# Altium schematic sheet 3V3_REG.SchDoc
size A4; SheetNumber: 11; SheetTotal: 19
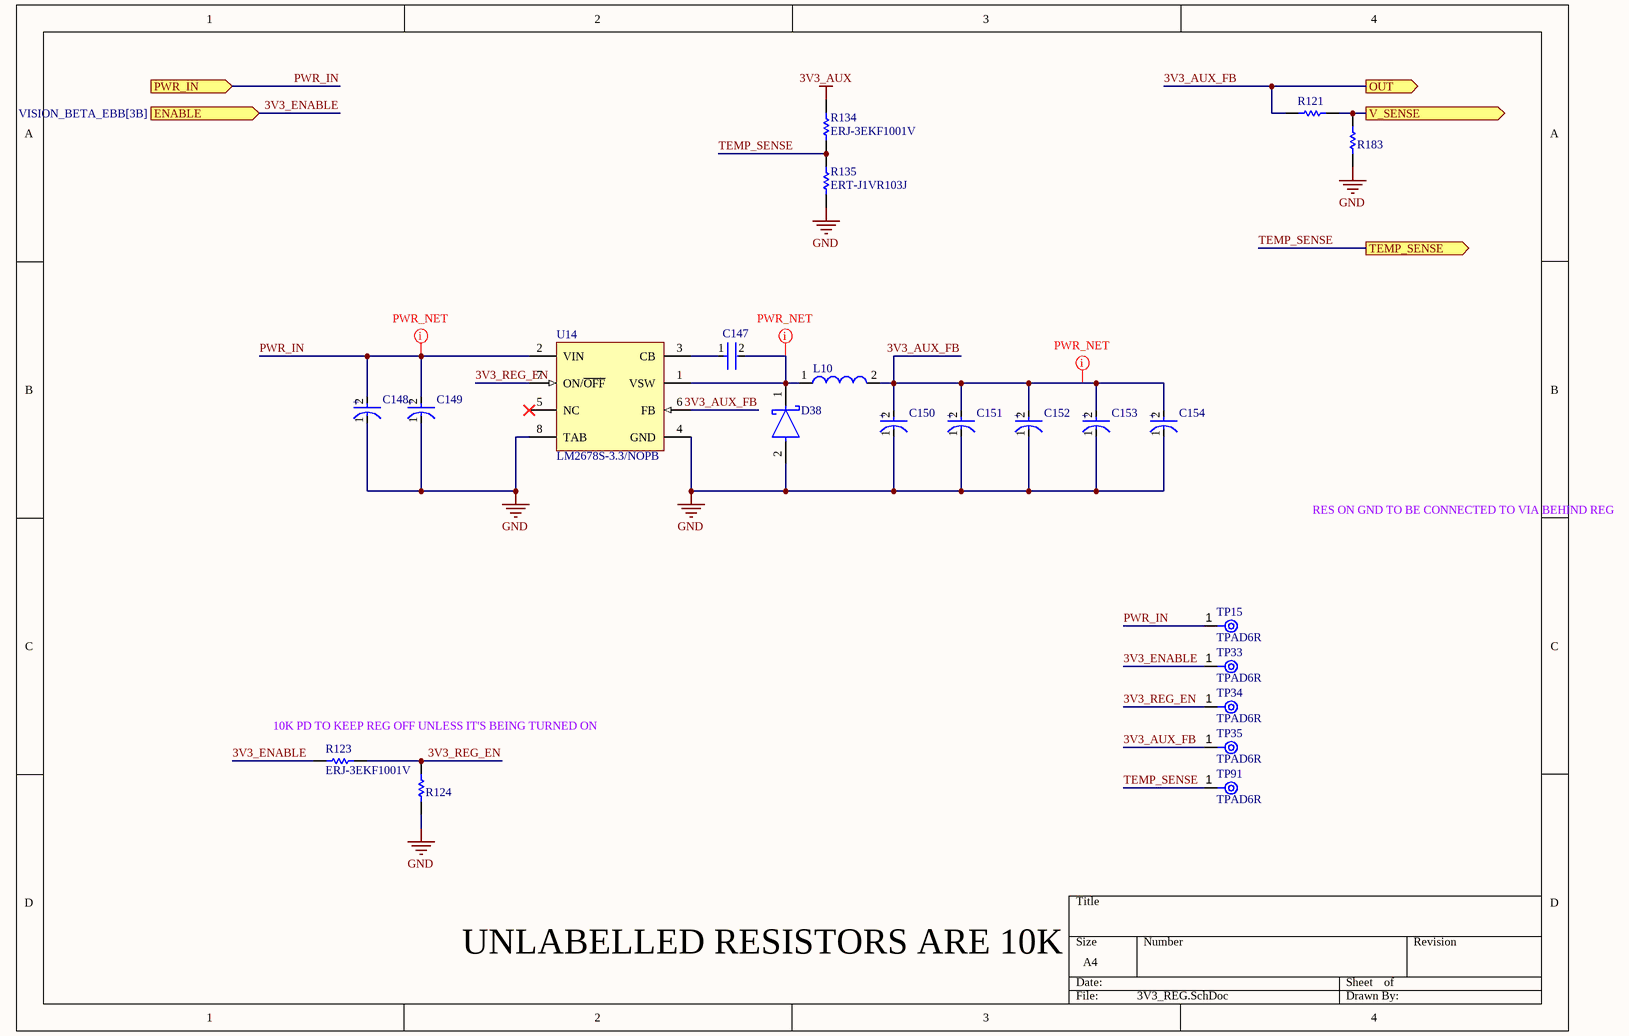
[diagram p0: 3V3_REG.SchDoc]

## Parts
C147  C0805C103J5RACTU  [FP-C0805C-DN-MFG]  (value not drawn)
C148  EEHZA1V680XP  [FP-EEH-D8-MFG]  (value not drawn)
C149  EEHZA1V680XP  [FP-EEH-D8-MFG]  (value not drawn)
C150  16SVPC120M  [FP-OS-CON-SMT-E7-MFG]  (value not drawn)
C151  16SVPC120M  [FP-OS-CON-SMT-E7-MFG]  (value not drawn)
C152  16SVPC120M  [FP-OS-CON-SMT-E7-MFG]  (value not drawn)
C153  16SVPC120M  [FP-OS-CON-SMT-E7-MFG]  (value not drawn)
C154  16SVPC120M  [FP-OS-CON-SMT-E7-MFG]  (value not drawn)
D38  B540C-13-F  [FP-SMC-MFG]  (value not drawn)
L10  74477110  [WE-PD-L]  (value not drawn)
R121  ERJ3EKF1002V  [RESC1609X55X30LL15T15]  (value not drawn)
R123  ERJ-3EKF1001V  [RESC1608X55X30LL15T15]
R124  ERJ3EKF1002V  [RESC1609X55X30LL15T15]  (value not drawn)
R134  ERJ-3EKF1001V  [RESC1608X55X30LL15T15]
R135  ERT-J1VR103J  [RESC1608X90X30ML15T20]
R183  ERJ3EKF1002V  [RESC1609X55X30LL15T15]  (value not drawn)
TP15  TPAD6R  [New footprint 1]
TP33  TPAD6R  [New footprint 1]
TP34  TPAD6R  [New footprint 1]
TP35  TPAD6R  [New footprint 1]
TP91  TPAD6R  [New footprint 1]
U14  LM2678S-3.3/NOPB  [KTW0007B_N]

## Ports
ENABLE (in, see VISION_BETA_EBB[3B]), OUT (out, see VISION_BETA_EBB[3B]), PWR_IN (in, see VISION_BETA_EBB[3B]), TEMP_SENSE (out, see VISION_BETA_EBB[3B]), V_SENSE (out, see VISION_BETA_EBB[3B])

## Nets
3V3_AUX: R134.2
GND: C148.1(C) C149.1(C) C150.1(C) C151.1(C) C152.1(C) C153.1(C) C154.1(C) D38.2(A) R124.1 R135.1 R183.1 U14.4(GND) U14.8(TAB)
3V3_AUX_FB: C150.2(A) C151.2(A) C152.2(A) C153.2(A) C154.2(A) L10.2 R121.1 TP35.1(TP) U14.6(FB) ; port OUT
3V3_ENABLE: R123.1 TP33.1(TP) ; port ENABLE
3V3_REG_EN: R123.2 R124.2 TP34.1(TP) U14.7(ON/~{OFF})
PWR_IN: C148.2(A) C149.2(A) TP15.1(TP) U14.2(VIN) ; port PWR_IN
TEMP_SENSE: R134.1 R135.2 TP91.1(TP) ; port TEMP_SENSE
V_SENSE: R121.2 R183.2 ; port V_SENSE
NetC147_1: C147.1 U14.3(CB)
NetC147_2: C147.2 D38.1(C) L10.1 U14.1(VSW)

Not connected (* = marked no-connect by the designer): U14 5(NC)*

## Layout directives
net class PWR: 3V3_AUX_FB, NetC147_2, PWR_IN

## Notes on the sheet
- RES ON GND TO BE CONNECTED TO VIA BEHIND REG
- 10K PD TO KEEP REG OFF UNLESS IT'S BEING TURNED ON
- UNLABELLED RESISTORS ARE 10K
- (in symbol CMP-05428-000021-2) +
- (in symbol CMP-05428-001211-1) +

## Library data of the parts
C147 = CMP-2007-00254-2: CAP CER 10000PF 50V X7R 0805; Manufacturer: KEMET; Value: 10,000 pF; Material: Ceramic; Temperature Coefficient: 30ppm/°C; Tolerance: 0.05; Device Class L1: Passive Components; Temperature: -55°C to +125°C; Lead Free: Yes; ComponentLink2URL: https://content.kemet.com/datasheets/KEM_C1003_C0G_SMD.pdf; Device Class L3: Ceramic Capacitors; Temperature Characteristic: X7R; Temperature Range High: +125°C; Mouser Description: Capacitor; Ceramic; Cap 0.01uF; Tol 5%; Vol-Rtg 50 V; SMT; Case 0805; X7R; TR; ComponentLink2Description: Datasheet; Manufacturer Part Number: C0805C103J5RACTU; Height: 0.88mm; Digikey Description: CAP CER 10000PF 50V X7R 0805; Capacitance: 10,000 pF; Temperature Range Low: -55°C; Device Class L2: Capacitors; Octopart: https://octopart.com/c0805c103j5ractu-kemet-133473; Voltage Rating: 50 V; Category: Cap; RoHS: TRUE; Automotive: No; Package: C0805C-DN; Ipc Land Pattern Name: CAPC200125X78
C148 C149 = CMP-05428-001211-1: Conductive Polymer Hybrid Aluminum Electrolytic Capacitors 68uF ±20% 35V RADIAL SMT 6.3x7.7mm; Leakage Current: 23.8uA; Ripple Current (AC): 2A; Polarity: Polar; Life (Hours): 5000Hour; ESR (Equivalent Series Resistance): 35mR; Lead Diameter: 0.65mm; Termination: SMD/SMT; Case/Package: Radial; Package Quantity: 900; Radiation Hardening: No; Max Operating Temperature: 105°C; Capacitance: 68uF; Voltage Rating: 35V; Number of Pins: 8; Mount: Surface Mount; Technology: HYBRID; Diameter: 6.3mm; Min Operating Temperature: -55°C; Length: 7.7mm; Ratings: AEC-Q200; Height - Seated (Max): 0.315inch; Ripple Current: 2A; Lead Free: Lead Free; Voltage: 35V; Lead Pitch: 1.8mm; Voltage Rating (DC): 35V; REACH SVHC: No SVHC; Material: Polymer; Height: 7.7mm; Tolerance: 20%; Construction: Cylindrical; Packaging: Tape and Reel; Series: ZA
C150-C154 = CMP-05428-000021-2: Conductive Polymer Aluminum Solid Capacitors (OS-CON) 120uF ±20% 16V RADIAL SMT 8x6.9mm; Leakage Current: 500uA; Ripple Current: 2.9A; ESR (Equivalent Series Resistance): 27mR; Polarity: Polar; Dissipation Factor: 12%; Life (Hours): 2000Hour; Lead Free: Lead Free; Voltage Rating (DC): 16V; Min Operating Temperature: -55°C; Height - Seated (Max): 0.276inch; Case/Package: Radial; REACH SVHC: No SVHC; Diameter: 8mm; Mount: Surface Mount; Package Quantity: 1000; Construction: Cylindrical; Max Operating Temperature: 105°C; Capacitance: 120uF; Voltage: 16V; Length: 6.9mm; Tolerance: 20%; RoHS Compliant: Yes; Series: OS-CON, SVPC; Packaging: Tape and Reel; Voltage Rating: 16V; Termination: SMD/SMT; Number of Pins: 7; Ripple Current (AC): 2.9A; Height: 6.9mm
D38 = CMP-2000-05097-3: DIODE SCHOTTKY 40V 5A SMC; Manufacturer: Diodes Inc.; Automotive Grade: NA; Peak Reverse Current: 0.5mA; Value: 300pF; Max Junction Temp: +150°C; Max Surge Forward Current: 100A; Standoff Height: 0.1mm; Digikey Description: DIODE SCHOTTKY 40V 5A SMC; Temperature Range Low: -55°C; Manufacturer Part Number: B540C-13-F; Octopart: https://octopart.com/b540c-13-f-diodes+inc.-325873; Lead Free: Yes; Reverse Voltage: 40V; RoHS: TRUE; Category: Diode; Mouser Description: Diode: Schottky rectifying; SMD; 40V; 5A; SMC; Package: reel, tape; ComponentLink2Description: Datasheet; Temperature Range High: +150°C; Automotive: No; Footprint Url: https://www.diodes.com/assets/Package-Files/SMC.pdf; Device Class L3: Schottky Diodes; Height: 2.5mm; Forward Current: 5A; Temperature: -55°C to +150°C; Package: SMC; ComponentLink2URL: https://www.diodes.com/assets/Datasheets/ds13012.pdf; Device Class L2: Diodes; Max Repetitive Reverse Voltage: 40V; Device Class L1: Discrete Semiconductors; Capacitance: 300pF
L10 = CMP-0227-00708-1: SMD-Shielded Power Inductor WE-PD, L = 10.0 µH; Inductance: 10.0 ÂµH; ComponentLink2Description: Datasheet; DatasheetVersion: ver 7, Sep-2006; PackageVersion: 2006; ComponentLink1URL: http://www.we-online.com; ComponentLink1Description: Manufacturer Link; ComponentLink2URL: http://www.we-online.de/katalog/media/pdf/74477110.pdf; PackageDescription: SMD Inductor, 2-Leads, Body 12.0 x 12.0 mm; PackageReference: WE-PD-L
R121 R124 R183 = CMP-1012-00623-3: Chip Resistor, 10 KOhm, +/- 1%, 0.1 W, -55 to 155 degC, 0603 (1608 Metric), RoHS, Tape and Reel; Manufacturer: Panasonic; Voltage Rating: 75V; Case\/Package: 0603; Power Rating: 100mW; Resistance: 10KOhm; Temperature Coefficient: 100ppm\/degreesC; Number of Pins: 2; Package Reference: 603; Depth: 0.8mm; Mount: SurfaceMount; Package Description: 2-Pin Surface Mount Device, Body 1.6 x 0.85 mm; Datasheet Version: 02/2017; Length: 1.6mm; Lead Free: LeadFree; Height: 0.45mm; Number of Terminations: 2; Max Power Dissipation: 100mW; Min Operating Temperature: -55degC; Datasheet URL: https://industrial.panasonic.com/cdbs/www-data/pdf/RDA0000/AOA0000C304.pdf; Termination: SMD/SMT; Case Code (Metric): 1608; Case Code (Imperial): 0603; Tolerance: 1%; Max Operating Temperature: 155degC; RoHSCompliant: true; Voltage Rating (DC): 75V; Radiation Hardening: No; Packaging: TapeandReel; Composition: ThickFilm; Mounting Technology: SurfaceMount; Manufacturer URL: http://www.panasonic.com/; Width: 0.031inch; REACH SVHC: NoSVHC; Contact Plating: Tin; Military Standard: Not; Package Quantity: 1
R123 R134 = CMP-2000-00180-1: Manufacturer: Panasonic; Part Number: ERJ-3EKF1001V
R135 = CMP-2000-00869-1: Manufacturer: Panasonic; Part Number: ERT-J1VR103J
TP15 TP33-TP35 TP91 = CMP-00025-2: Test Point .6mm
U14 = CMP-0069-00195-3: SIMPLE SWITCHER® High Efficiency 5A Step-Down Voltage Regulator, 7-pin TO-263, Pb-Free; Manufacturer: Texas Instruments; PackageTopMarking: NSUZXYTTE#*LM2678*S-3.3; PowerWise: N; PackageReference: KTW0007B; Code_JEDEC: MO-169-AC; CompType: Switcher; RoHS: Y; PackageDescription: TO-263, Molded, .400 x .390 x .180in Body, 7 Lead, .050in Pitch, Surface Mount; ComponentLink1Description: Datasheet URL; PinCount: 7; ComponentLink1URL: http://www.ti.com/general/docs/lit/getliterature.tsp?genericPartNumber=LM2678&fileType=pdf